# Altium schematic sheet 16-PWR_2.SchDoc: KARGOBOT-TBOX-V2.0
size 513 x 386 mm; Page Create Date: March  8, 1995; Page Number: 4; Page Size: C; Page Count: 81; RevCode: A; DsnPath: C:\Users\Administrator\Desktop\123\KARGOBOT-TCU-ORIN-V1.1.DSN; SchematicName: KARGOBT-TCU-ORIN-V1.1; PageName: N100; PageSize: C; TopSchematic: True
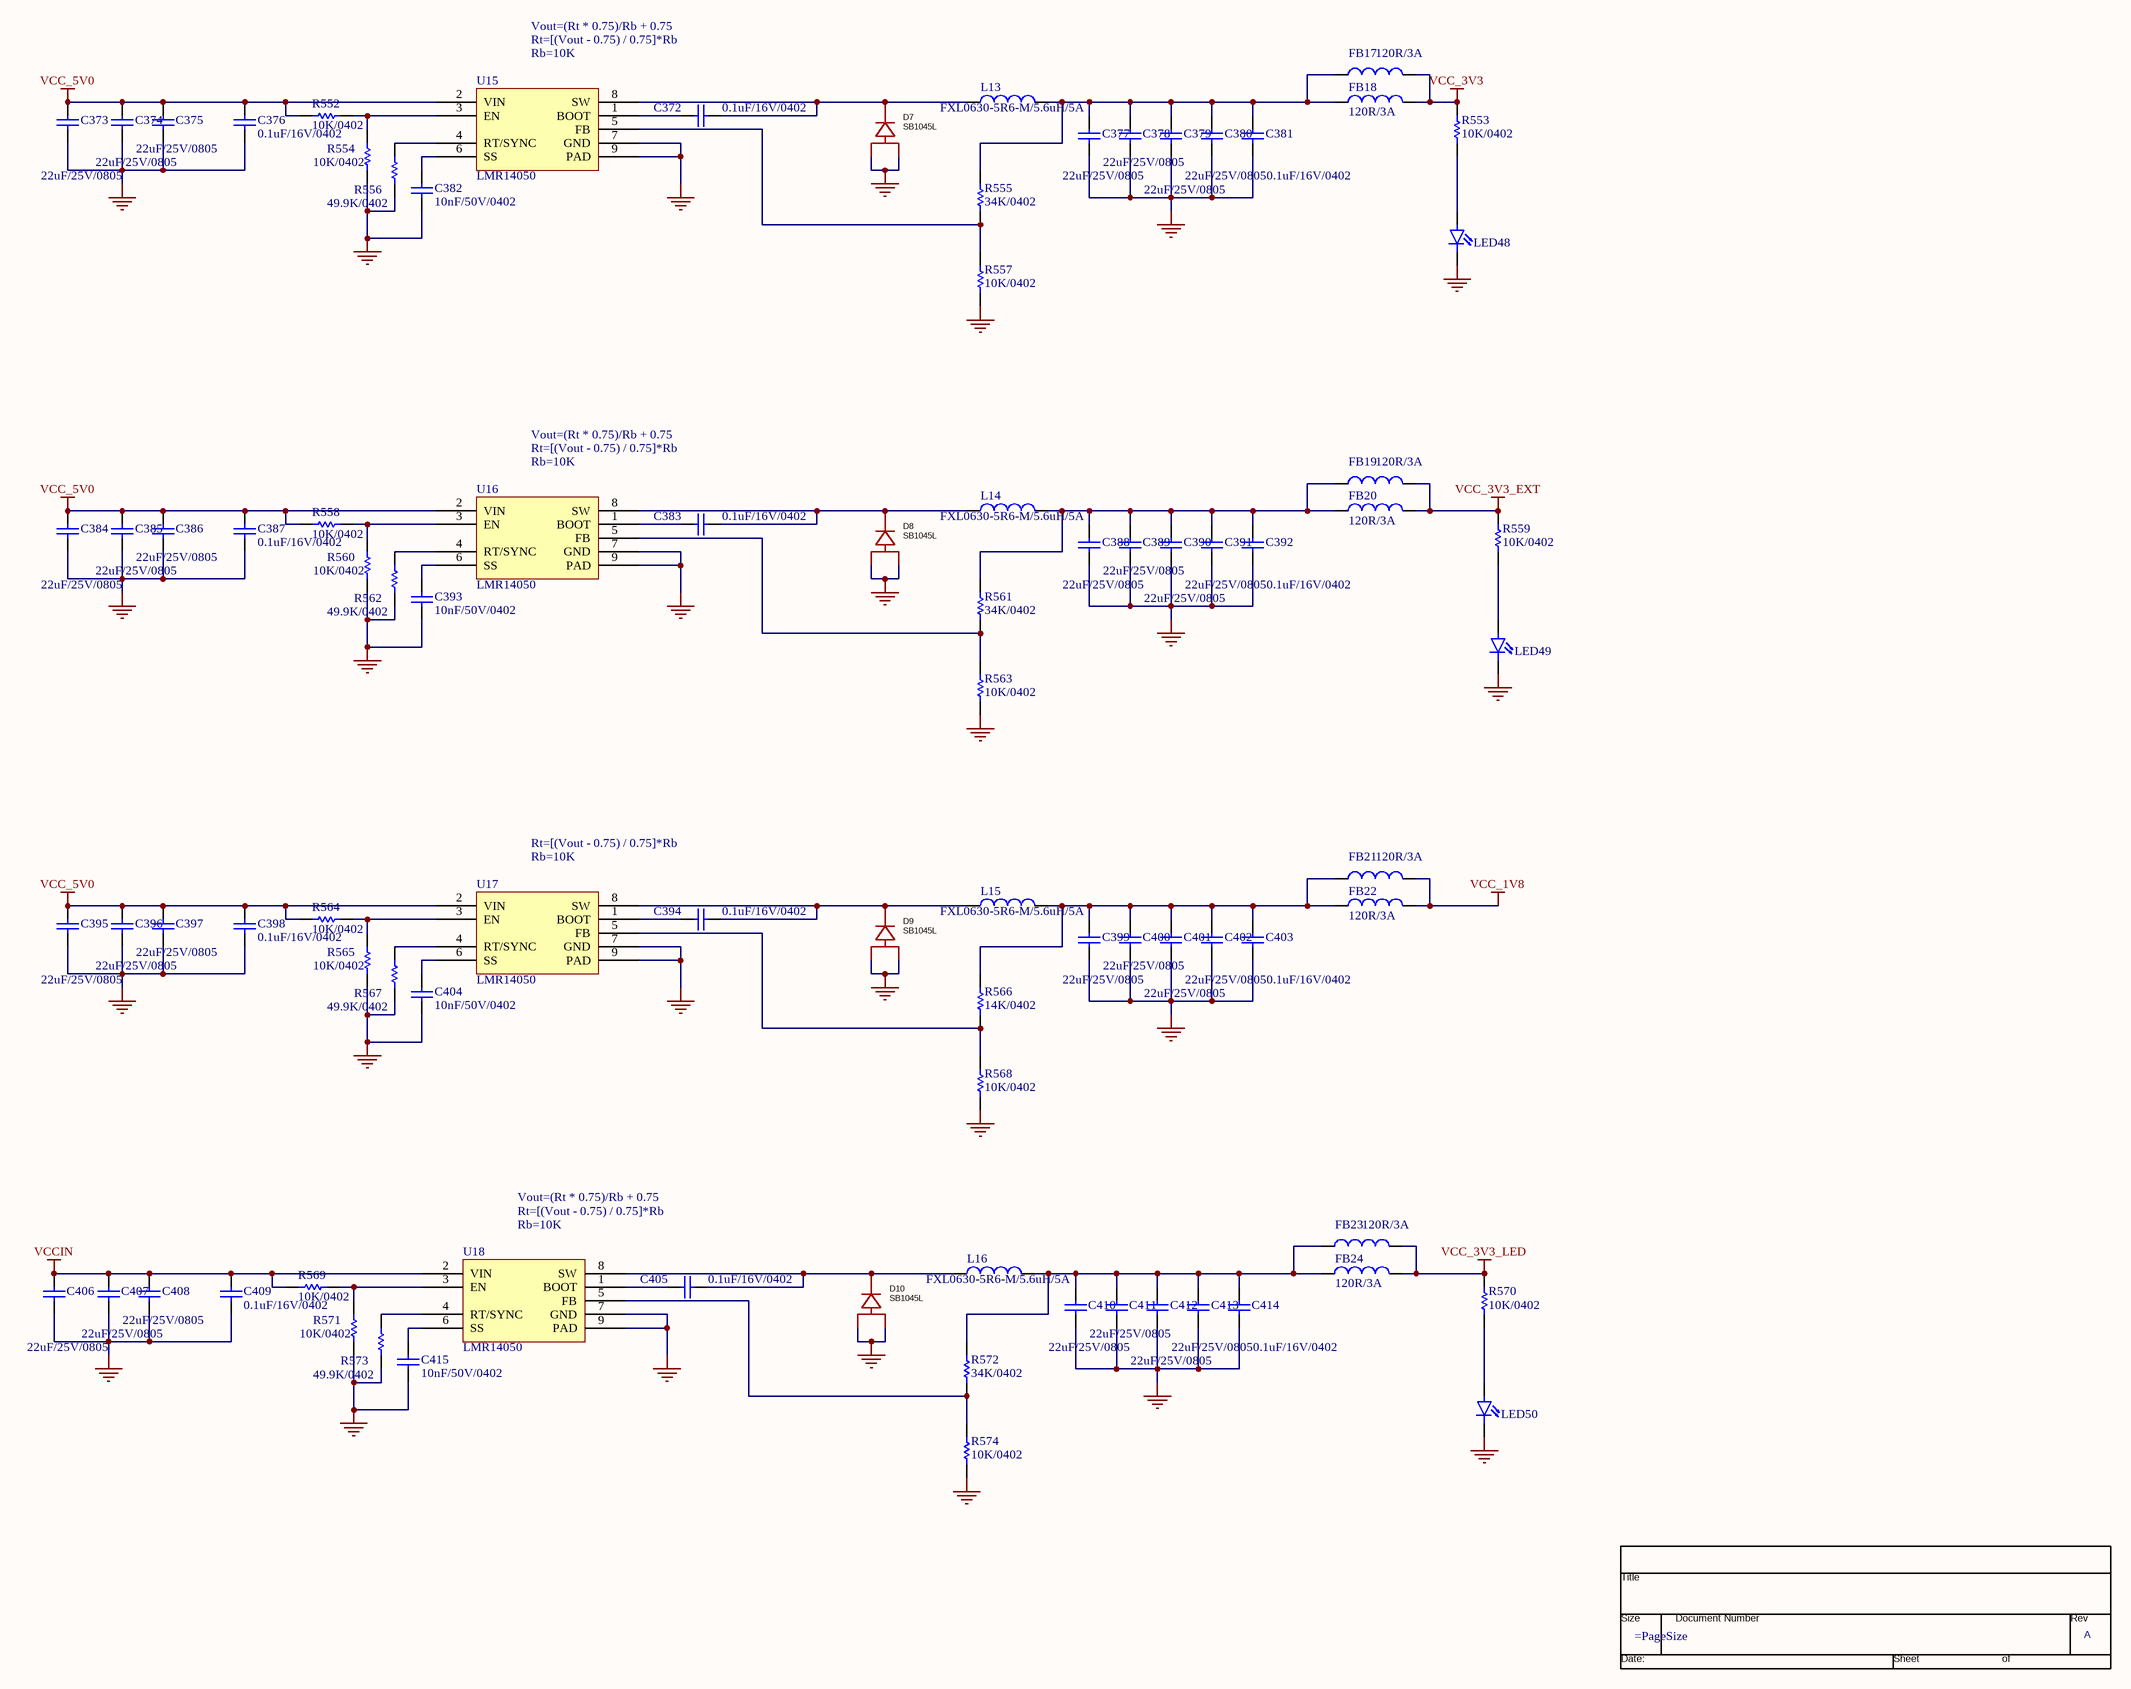
[diagram p0: 16-PWR_2.SchDoc]

## Parts
*  RevCode: A  (graphical)
C372  0.1uF/16V/0402  [C0402]
C373  22uF/25V/0805  [C0805]
C374  22uF/25V/0805  [C0805]
C375  22uF/25V/0805  [C0805]
C376  0.1uF/16V/0402  [C0402]
C377  22uF/25V/0805  [C0805]
C378  22uF/25V/0805  [C0805]
C379  22uF/25V/0805  [C0805]
C380  22uF/25V/0805  [C0805]
C381  0.1uF/16V/0402  [C0402]
C382  10nF/50V/0402  [C0402]
C383  0.1uF/16V/0402  [C0402]
C384  22uF/25V/0805  [C0805]
C385  22uF/25V/0805  [C0805]
C386  22uF/25V/0805  [C0805]
C387  0.1uF/16V/0402  [C0402]
C388  22uF/25V/0805  [C0805]
C389  22uF/25V/0805  [C0805]
C390  22uF/25V/0805  [C0805]
C391  22uF/25V/0805  [C0805]
C392  0.1uF/16V/0402  [C0402]
C393  10nF/50V/0402  [C0402]
C394  0.1uF/16V/0402  [C0402]
C395  22uF/25V/0805  [C0805]
C396  22uF/25V/0805  [C0805]
C397  22uF/25V/0805  [C0805]
C398  0.1uF/16V/0402  [C0402]
C399  22uF/25V/0805  [C0805]
C400  22uF/25V/0805  [C0805]
C401  22uF/25V/0805  [C0805]
C402  22uF/25V/0805  [C0805]
C403  0.1uF/16V/0402  [C0402]
C404  10nF/50V/0402  [C0402]
C405  0.1uF/16V/0402  [C0402]
C406  22uF/25V/0805  [C0805]
C407  22uF/25V/0805  [C0805]
C408  22uF/25V/0805  [C0805]
C409  0.1uF/16V/0402  [C0402]
C410  22uF/25V/0805  [C0805]
C411  22uF/25V/0805  [C0805]
C412  22uF/25V/0805  [C0805]
C413  22uF/25V/0805  [C0805]
C414  0.1uF/16V/0402  [C0402]
C415  10nF/50V/0402  [C0402]
D7  SB1045L  [TO-277_3P-L5.4-W4.0-LS6.5-TR]
D8  SB1045L  [TO-277_3P-L5.4-W4.0-LS6.5-TR]
D9  SB1045L  [TO-277_3P-L5.4-W4.0-LS6.5-TR]
D10  SB1045L  [TO-277_3P-L5.4-W4.0-LS6.5-TR]
FB17  120R/3A  [L0603]
FB18  120R/3A  [L0603]
FB19  120R/3A  [L0603]
FB20  120R/3A  [L0603]
FB21  120R/3A  [L0603]
FB22  120R/3A  [L0603]
FB23  120R/3A  [L0603]
FB24  120R/3A  [L0603]
L13  FXL0630-5R6-M/5.6uH/5A  [FXL0630-5R6-M]
L14  FXL0630-5R6-M/5.6uH/5A  [FXL0630-5R6-M]
L15  FXL0630-5R6-M/5.6uH/5A  [FXL0630-5R6-M]
L16  FXL0630-5R6-M/5.6uH/5A  [FXL0630-5R6-M]
LED48  LED_GREEN  [LED0603]  (value not drawn)
LED49  LED_GREEN  [LED0603]  (value not drawn)
LED50  LED_GREEN  [LED0603]  (value not drawn)
R552  10K/0402  [R0402]
R553  10K/0402  [R0402]
R554  10K/0402  [R0402]
R555  34K/0402  [R0402]
R556  49.9K/0402  [R0402]
R557  10K/0402  [R0402]
R558  10K/0402  [R0402]
R559  10K/0402  [R0402]
R560  10K/0402  [R0402]
R561  34K/0402  [R0402]
R562  49.9K/0402  [R0402]
R563  10K/0402  [R0402]
R564  10K/0402  [R0402]
R565  10K/0402  [R0402]
R566  14K/0402  [R0402]
R567  49.9K/0402  [R0402]
R568  10K/0402  [R0402]
R569  10K/0402  [R0402]
R570  10K/0402  [R0402]
R571  10K/0402  [R0402]
R572  34K/0402  [R0402]
R573  49.9K/0402  [R0402]
R574  10K/0402  [R0402]
U15  LMR14050  [LMR14030]
U16  LMR14050  [LMR14030]
U17  LMR14050  [LMR14030]
U18  LMR14050  [LMR14030]

## Nets
GND: C373.1 C374.1 C375.1 C376.1 C377.1 C378.1 C379.1 C380.1 C381.1 C382.1 C384.1 C385.1 C386.1 C387.1 C388.1 C389.1 C390.1 C391.1 C392.1 C393.1 C395.1 C396.1 C397.1 C398.1 C399.1 C400.1 C401.1 C402.1 C403.1 C404.1 C406.1 C407.1 C408.1 C409.1 C410.1 C411.1 C412.1 C413.1 C414.1 C415.1 D7.1(A) D7.3(A) D8.1(A) D8.3(A) D9.1(A) D9.3(A) D10.1(A) D10.3(A) LED48.2 LED49.2 LED50.2 R554.2 R556.2 R557.2 R560.2 R562.2 R563.2 R565.2 R567.2 R568.2 R571.2 R573.2 R574.2 U15.7(GND) U15.9(PAD) U16.7(GND) U16.9(PAD) U17.7(GND) U17.9(PAD) U18.7(GND) U18.9(PAD)
VCC_1V8: FB21.2 FB22.2
VCC_3V3: FB17.2 FB18.2 R553.1
VCC_3V3_EXT: FB19.2 FB20.2 R559.1
VCC_3V3_LED: FB23.2 FB24.2 R570.1
VCC_5V0: C373.2 C374.2 C375.2 C376.2 C384.2 C385.2 C386.2 C387.2 C395.2 C396.2 C397.2 C398.2 R552.2 R558.2 R564.2 U15.2(VIN) U16.2(VIN) U17.2(VIN)
VCCIN: C406.2 C407.2 C408.2 C409.2 R569.2 U18.2(VIN)
NetC372_1: C372.1 D7.2(K) L13.1 U15.8(SW)
NetC372_2: C372.2 U15.1(BOOT)
NetC377_2: C377.2 C378.2 C379.2 C380.2 C381.2 FB17.1 FB18.1 L13.2 R555.1
NetC382_2: C382.2 U15.6(SS)
NetC383_1: C383.1 D8.2(K) L14.1 U16.8(SW)
NetC383_2: C383.2 U16.1(BOOT)
NetC388_2: C388.2 C389.2 C390.2 C391.2 C392.2 FB19.1 FB20.1 L14.2 R561.1
NetC393_2: C393.2 U16.6(SS)
NetC394_1: C394.1 D9.2(K) L15.1 U17.8(SW)
NetC394_2: C394.2 U17.1(BOOT)
NetC399_2: C399.2 C400.2 C401.2 C402.2 C403.2 FB21.1 FB22.1 L15.2 R566.1
NetC404_2: C404.2 U17.6(SS)
NetC405_1: C405.1 D10.2(K) L16.1 U18.8(SW)
NetC405_2: C405.2 U18.1(BOOT)
NetC410_2: C410.2 C411.2 C412.2 C413.2 C414.2 FB23.1 FB24.1 L16.2 R572.1
NetC415_2: C415.2 U18.6(SS)
NetLED48_1: LED48.1 R553.2
NetLED49_1: LED49.1 R559.2
NetLED50_1: LED50.1 R570.2
NetR552_1: R552.1 R554.1 U15.3(EN)
NetR555_2: R555.2 R557.1 U15.5(FB)
NetR556_1: R556.1 U15.4(RT/SYNC)
NetR558_1: R558.1 R560.1 U16.3(EN)
NetR561_2: R561.2 R563.1 U16.5(FB)
NetR562_1: R562.1 U16.4(RT/SYNC)
NetR564_1: R564.1 R565.1 U17.3(EN)
NetR566_2: R566.2 R568.1 U17.5(FB)
NetR567_1: R567.1 U17.4(RT/SYNC)
NetR569_1: R569.1 R571.1 U18.3(EN)
NetR572_2: R572.2 R574.1 U18.5(FB)
NetR573_1: R573.1 U18.4(RT/SYNC)

## Notes on the sheet
- (near U15) Rb=10K
- Rt=[(Vout - 0.75) / 0.75]*Rb
- Vout=(Rt * 0.75)/Rb + 0.75
- (near U16) Rb=10K
- (near U17) Rb=10K
- (near U18) Rb=10K
- (in symbol TitleBlock0) Title; Size; Document Number; Rev; Date:; Sheet; of

## Library data of the parts
* = TitleBlock0: Page Count: 81; Page Number: 4; Title: KARGOBOT-TBOX-V2.0; Page Size: =PageSize; Page Create Date: March  8, 1995; Page Modify Date: =ModifiedDate
C372-C415 = CAP: Capacitor; Value: 100pF; Published: 8-Jun-2000; Revision: July-2002: Re-released for DXP Platform.; Publisher: Altium Limited
D7-D10 = SB1045L_C908747: Manufacturer: GOODWORK(固得沃克); Add into BOM: yes; Diode Configuration: 独立式; Forward Voltage (Vf@If): 530mV@10A; Reverse Voltage (Vr): 45V; Average Rectified Current (Io): 10A; Reverse Leakage Current (Ir): 150uA@45V; Symbol: SB1045L_C908747; Device: SB1045L_C908747; LCSC Part Name: 电压:45V 电流:10A; Supplier Part: C908747; Manufacturer Part: SB1045L; Supplier Footprint: TO-277; JLCPCB Part Class: Extended Part; Datasheet: https://atta.szlcsc.com/upload/public/pdf/source/20210105/C908747_DE348528BC53D9CC51537B568EB9903F.pdf; Supplier: LCSC; Convert to PCB: yes; Comment_1: SB1045L
FB17-FB24 = Inductor: BLM18KG121TN1D; Code_IEC: 1005; Value: 10mH; Published: 8-Jun-2000; LatestRevisionDate: 29-May-2009; LatestRevisionNote: IPC-7351 Footprint Added.; PackageReference: 0402-A; Publisher: Altium Limited; PackageDescription: Chip Inductor; Code_JEITA: 0402
L13-L16 = Inductor: FXC0630-5R6M; Code_IEC: 1005; Value: 2.2uH; Published: 8-Jun-2000; LatestRevisionDate: 29-May-2009; LatestRevisionNote: IPC-7351 Footprint Added.; PackageReference: 0402-A; Publisher: Altium Limited; PackageDescription: Chip Inductor; Code_JEITA: 0402
LED48-LED50 = LED
R552 R554-R558 R560-R569 R571-R574 = Res Semi: Semiconductor Resistor; Value: 240R; Published: 8-Jun-2000; LatestRevisionDate: 17-Jul-2002; LatestRevisionNote: Re-released for DXP Platform.; PackageReference: AXIAL-0.5; Publisher: Altium Limited; PackageDescription: Axial Device, Thru-Hole; 2 Leads; 0.5 in Pin Spacing
R553 R559 R570 = Res Semi: Semiconductor Resistor; Value: 1K; Published: 8-Jun-2000; LatestRevisionDate: 17-Jul-2002; LatestRevisionNote: Re-released for DXP Platform.; PackageReference: AXIAL-0.5; Publisher: Altium Limited; PackageDescription: Axial Device, Thru-Hole; 2 Leads; 0.5 in Pin Spacing
U15-U18 = LMR14030